# Altium project Challenge_2_actual.PrjPcb
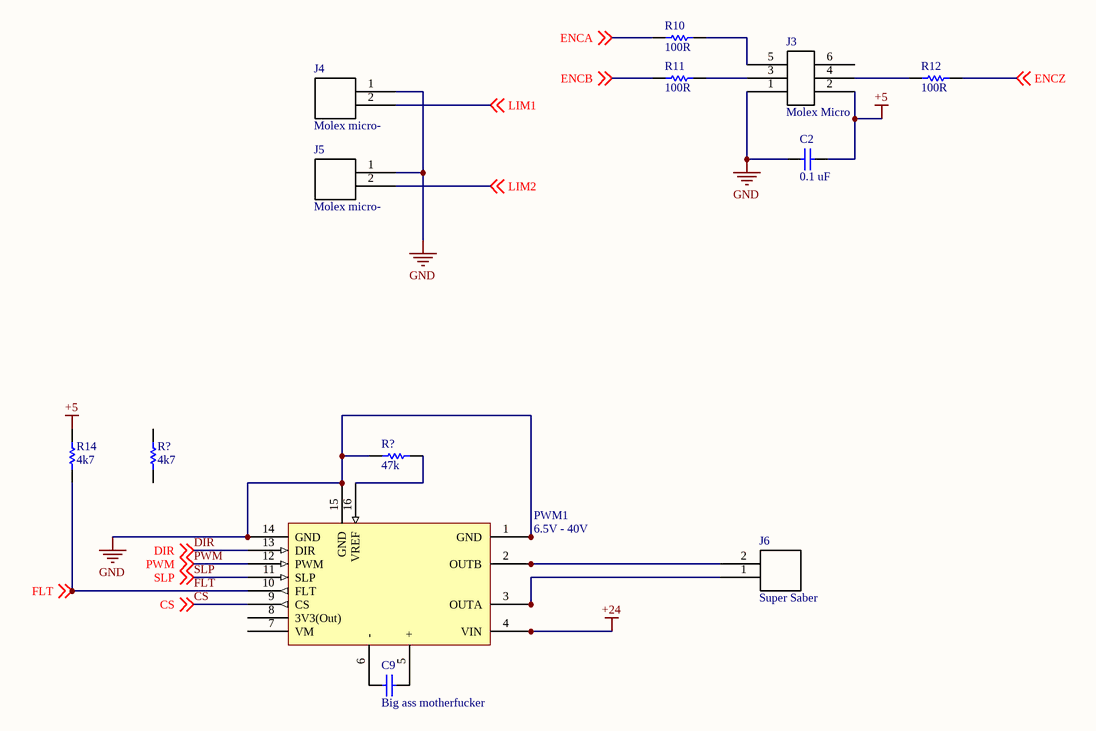
[diagram p0: Motor_Interface.SchDoc]
3 sheets, 45 parts. Net scope: flat (ports and power ports of the same name join across sheets).
Board file: Challenge_2_actual.PcbDoc
Sheets:
  Motor_Interface.SchDoc
  CAN.SchDoc
  MC_Sheet.SchDoc

## Sheet Motor_Interface.SchDoc
size B

### Parts
(Parts that share a designator on the sheet are numbered #1, #2 ... from top to bottom, then left to right.)
C2  0.1 uF  [CAPC2013X140X50LL20T25]
C9  Big ass motherfucker  [CAPC2013X140X50LL20T25]
J3  Molex Micro  [microfit 6 pin]
J4  Molex micro-  [Microfit 2 pin]
J5  Molex micro-  [Microfit 2 pin]
J6  Super Saber  [Super Sabre]
PWM1  6.5V - 40V  [Pololu_G2_Driver_24v21]
R10  100R  [RESC0805(2012)_N]
R11  100R  [RESC0805(2012)_N]
R12  100R  [RESC0805(2012)_N]
R14  4k7  [RESC0805(2012)_N]
R?#1  47k  [RESC0805(2012)_N]
R?#2  4k7  [RESC0805(2012)_N]

### Nets
+5: C2.2 J3.2 R14.2
+24: PWM1.4(VIN) PWM1.4a(VIN) PWM1.4b(VIN)
GND: C2.1 J3.1 J4.1 J5.1 PWM1.1(GND) PWM1.1a(GND) PWM1.1b(GND) PWM1.14(GND) PWM1.15(GND) R?#1.1
CS: PWM1.9(CS) ; off-sheet CS
DIR: PWM1.13(DIR) ; off-sheet DIR
ENCA: R10.1 ; off-sheet ENCA
ENCB: R11.1 ; off-sheet ENCB
ENCZ: R12.2 ; off-sheet ENCZ
FLT: PWM1.10(FLT) R14.1 ; off-sheet FLT
LIM1: J4.2 ; off-sheet LIM1
LIM2: J5.2 ; off-sheet LIM2
PWM: PWM1.12(PWM) ; off-sheet PWM
SLP: PWM1.11(SLP) ; off-sheet SLP
NetC9_1: C9.1 PWM1.6(-)
NetC9_2: C9.2 PWM1.5(+)
NetJ3_3: J3.3 R11.2
NetJ3_4: J3.4 R12.1
NetJ3_5: J3.5 R10.2
NetJ6_1: J6.1 PWM1.3(OUTA) PWM1.3a(OUTA) PWM1.3b(OUTA)
NetJ6_2: J6.2 PWM1.2(OUTB) PWM1.2a(OUTB) PWM1.2b(OUTB)
NetPWM1_16: PWM1.16(VREF) R?#1.2

Not connected (* = marked no-connect by the designer): J3 6; PWM1 7(VM) 8(3V3(Out)); R?#2 1 2

### Library data of the parts
C2 C9 = CMP-2000-05810-1: Chip Capacitor, 2.2 uF, +/- 10%, 10 V, -55 to 85 degC, 0805 (2012 Metric), RoHS, Tape and Reel; Manufacturer: AVX; Dielectric: X5R; Rated Voltage: 10V; Capacitance: 2.2µF; Tolerance (%): ±10%; Datasheet Version: 05/2016; Manufacturer URL: http://www.avx.com/; Package Description: 2-Pin Surface Mount Device, Body 2.01 x 1.25 mm; Mounting Technology: SurfaceMount; Case Size/Dimension: 0805; Package Reference: 0805; Datasheet URL: http://datasheets.avx.com/cx5r.pdf
J3 = Molex micro-fit 6-pin (dual row schematic): Molex micro-fit 3.0 dual row connector. P/N 0430450627
J4 J5 = Molex micro-fit 2-pin: Molex micro-fit 3.0. Molex P/N 0430450227
PWM1 = Pololu G2 High-Power Motor Driver 24v21: This discrete MOSFET H-bridge motor driver enables bidirectional control of one high-power DC brushed motor. The small 1.3″ × 0.8″ board supports a wide 6.5 V to 40 V voltage range and is efficient enough to deliver a continuous 21 A without a heat sink. Additional features of this second-generation (G2) driver include reverse-voltage protection along with basic current sensing and current limiting functionality.; ComponentLink1Description: Product Info; ComponentLink1URL: https://www.pololu.com/product/2995/specs
R10-R12 R14 R?#1 R?#2 = Resistor 0805: Generic 0805 Resistor; Tolerance: 5 %; Case-Metric: 2012; Value: 120.00 Ohm; Case-EIA: 0805; Power: 0.125 W; Technology: SMT

## Sheet CAN.SchDoc
size B
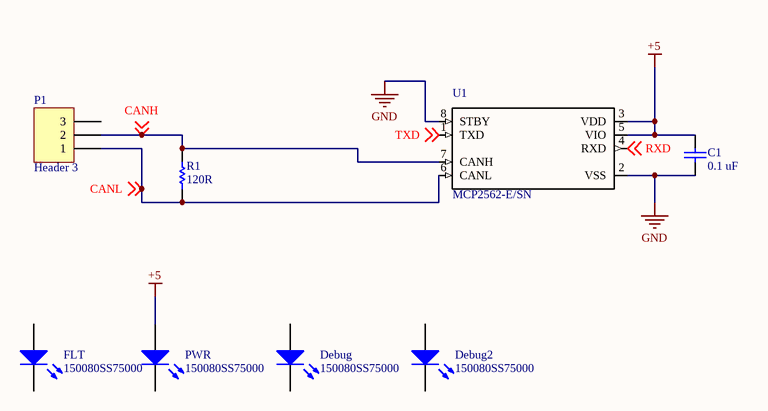
[diagram p1: CAN.SchDoc]

### Parts
C1  0.1 uF  [CAPC2013X140X50LL20T25]
Debug  150080SS75000  [0805_A]
Debug2  150080SS75000  [0805_A]
FLT  150080SS75000  [0805_A]
P1  Header 3  [HDR1X3]
PWR  150080SS75000  [0805_A]
R1  120R  [RESC0805(2012)_N]
U1  MCP2562-E/SN  [SOIC127P600X175-8N]

### Nets
+5: C1.1 PWR.2(A) U1.3(VDD) U1.5(VIO)
GND: C1.2 U1.2(VSS) U1.8(STBY)
CANH: P1.2 R1.2 U1.7(CANH) ; off-sheet CANH
CANL: P1.1 R1.1 U1.6(CANL) ; off-sheet CANL
RXD: U1.4(RXD) ; off-sheet RXD
TXD: U1.1(TXD) ; off-sheet TXD

Not connected (* = marked no-connect by the designer): Debug 1(K) 2(A); Debug2 1(K) 2(A); FLT 1(K) 2(A); P1 3; PWR 1(K)

### Library data of the parts
C1 = CMP-2000-05810-1: as C2 on sheet Motor_Interface; Tolerance (%): ±10%; Datasheet Version: 05/2016; Manufacturer URL: http://www.avx.com/; Package Description: 2-Pin Surface Mount Device, Body 2.01 x 1.25 mm; Mounting Technology: SurfaceMount; Case Size/Dimension: 0805; Package Reference: 0805; Datasheet URL: http://datasheets.avx.com/cx5r.pdf
Debug Debug2 FLT PWR = CMP-1426-00010-1: SMD mono-color Chip LED, WL-SMCW, Super Red; Manufacturer: Wuerth Elektronik; PackageReference: 0805_A; ComponentLink2URL: http://katalog.we-online.com/led/datasheet/150080SS75000.pdf; ComponentLink1URL: http://www.we-online.com; Color: Super Red; ComponentLink2Description: Datasheet; ComponentLink1Description: Manufacturer URL; PartNumber: 150080SS75000
P1 = Header 3: Header, 3-Pin; LatestRevisionDate: 17-Jul-2002; LatestRevisionNote: Re-released for DXP Platform.; Publisher: Altium Limited
R1 = Resistor 0805: as R10 on sheet Motor_Interface; Technology: SMT
U1 = CAN Tranceiver: Microchip MCP2562-E/SN, CAN Transceiver 1MBps 1-channel IEC 61000-4-2, 8-Pin SOIC; Price: None; MF: Microchip; SnapEDA_Link: https://www.snapeda.com/parts/MCP2562-E/SN/Microchip/view-part/?ref=snap; MP: MCP2562-E/SN; Availability: Unavailable; Package: SO-8 Microchip; Value: *

## Sheet MC_Sheet.SchDoc
size B
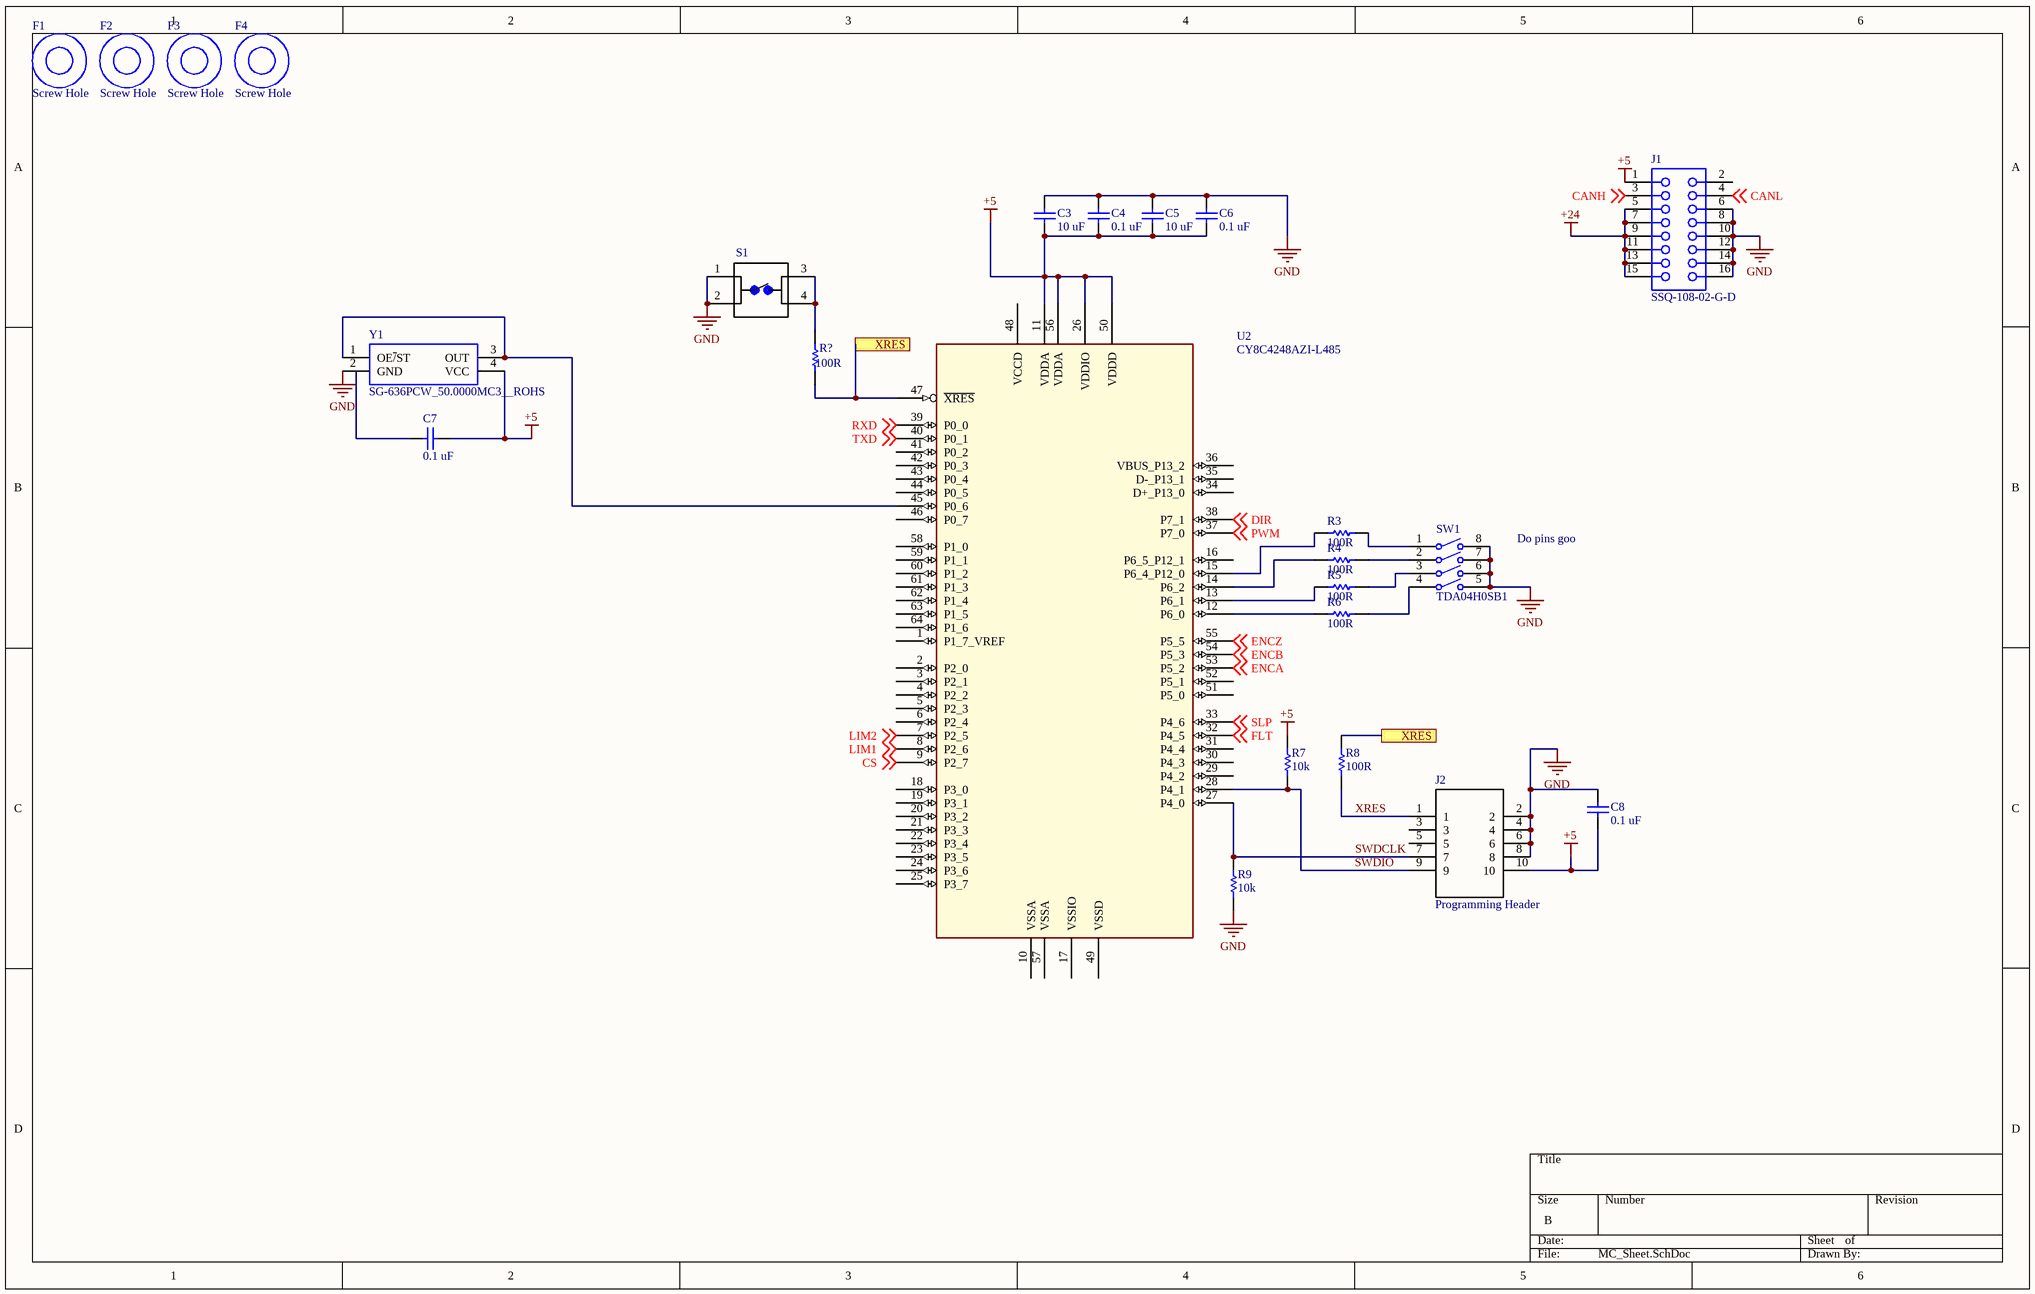
[diagram p2: MC_Sheet.SchDoc]

### Parts
(Parts that share a designator on the sheet are numbered #1, #2 ... from top to bottom, then left to right.)
C3  10 uF  [CAPC2013X140X50LL20T25]
C4  0.1 uF  [CAPC2013X140X50LL20T25]
C5  10 uF  [CAPC2013X140X50LL20T25]
C6  0.1 uF  [CAPC2013X140X50LL20T25]
C7  0.1 uF  [CAPC2013X140X50LL20T25]
C8  0.1 uF  [CAPC2013X140X50LL20T25]
F1  Screw Hole  [Screw Hole]
F2  Screw Hole  [Screw Hole]
F3  Screw Hole  [Screw Hole]
F4  Screw Hole  [Screw Hole]
J1  SSQ-108-02-G-D  [SMTC-SSQ-108-02-X-D]
J2  Programming Header  [programming]
R3  100R  [RESC0805(2012)_N]
R4  100R  [RESC0805(2012)_N]
R5  100R  [RESC0805(2012)_N]
R6  100R  [RESC0805(2012)_N]
R7  10k  [RESC0805(2012)_N]
R8  100R  [RESC0805(2012)_N]
R9  10k  [RESC0805(2012)_N]
R?#3  100R  [RESC0805(2012)_N]
S1  1825910-7  [Switch 6mm 24V (NO)]  (value not drawn)
SW1  TDA04H0SB1  [CKCP-TDA04H0SB1R_V]
U2  CY8C4248AZI-L485  [TQFP50P1200X1200X160-64N]
Y1  SG-636PCW_50.0000MC3__ROHS  [SG-636]

### Ports
XRES

### Nets
+5: C3.1 C4.1 C5.1 C6.1 C7.2 C8.1 J1.1 J2.10 R7.2 U2.11(VDDA) U2.26(VDDIO) U2.50(VDDD) U2.56(VDDA) Y1.4(VCC)
+24: J1.5 J1.7 J1.9 J1.11 J1.13 J1.15
GND: C3.2 C4.2 C5.2 C6.2 C8.2 J1.6 J1.8 J1.10 J1.12 J1.14 J1.16 J2.2 J2.4 J2.6 J2.8 R9.1 S1.1 S1.2 SW1.5 SW1.6 SW1.7 SW1.8 Y1.2(GND)
CANH: J1.3 ; off-sheet CANH
CANL: J1.4 ; off-sheet CANL
CS: U2.9(P2_7) ; off-sheet CS
DIR: U2.38(P7_1) ; off-sheet DIR
ENCA: U2.53(P5_2) ; off-sheet ENCA
ENCB: U2.54(P5_3) ; off-sheet ENCB
ENCZ: U2.55(P5_5) ; off-sheet ENCZ
FLT: U2.32(P4_5) ; off-sheet FLT
LIM1: U2.8(P2_6) ; off-sheet LIM1
LIM2: U2.7(P2_5) ; off-sheet LIM2
PWM: U2.37(P7_0) ; off-sheet PWM
RXD: U2.39(P0_0) ; off-sheet RXD
SLP: U2.33(P4_6) ; off-sheet SLP
SWDCLK: J2.7 R9.2 U2.27(P4_0)
SWDIO: J2.9 R7.1 U2.28(P4_1)
TXD: U2.40(P0_1) ; off-sheet TXD
XRES: J2.1 R8.1
NetR3_1: R3.1 SW1.1
NetR3_2: R3.2 U2.15(P6_4_P12_0)
NetR4_1: R4.1 SW1.2
NetR4_2: R4.2 U2.14(P6_2)
NetR5_1: R5.1 SW1.3
NetR5_2: R5.2 U2.13(P6_1)
NetR6_1: R6.1 SW1.4
NetR6_2: R6.2 U2.12(P6_0)
NetR8_2: R8.2 R?#3.1 U2.47(~{XRES}) ; port XRES
NetR?#3_2: R?#3.2 S1.3 S1.4
NetU2_45: U2.45(P0_6) Y1.1(OE~{/}ST) Y1.3(OUT)

Not connected (* = marked no-connect by the designer): C7 1; J1 2; J2 3 5; U2 1(P1_7_VREF) 2(P2_0) 3(P2_1) 4(P2_2) 5(P2_3) 6(P2_4) 10(VSSA) 16(P6_5_P12_1) 17(VSSIO) 18(P3_0) 19(P3_1) 20(P3_2) 21(P3_3) 22(P3_4) 23(P3_5) 24(P3_6) 25(P3_7) 29(P4_2) 30(P4_3) 31(P4_4) 34(D+_P13_0) 35(D-_P13_1) 36(VBUS_P13_2) 41(P0_2) 42(P0_3) 43(P0_4) 44(P0_5) 46(P0_7) 48(VCCD) 49(VSSD) 51(P5_0) 52(P5_1) 57(VSSA) 58(P1_0) 59(P1_1) 60(P1_2) 61(P1_3) 62(P1_4) 63(P1_5) 64(P1_6)

### Notes on the sheet
- Do pins goo

### Library data of the parts
C3-C8 = CMP-2000-05810-1: as C2 on sheet Motor_Interface; Tolerance (%): ±10%; Datasheet Version: 05/2016; Manufacturer URL: http://www.avx.com/; Package Description: 2-Pin Surface Mount Device, Body 2.01 x 1.25 mm; Mounting Technology: SurfaceMount; Case Size/Dimension: 0805; Package Reference: 0805; Datasheet URL: http://datasheets.avx.com/cx5r.pdf
F1-F4 = Screw Hole: Add 4 of these to your design for screw hole mounting
J1 = CMP-1023-00300-1: SQ Post Socket, Through-hole, Vertical, -55 to 125 degC, 2.54 mm Pitch, 16-Pin, Female, RoHS; Manufacturer: Samtec; Pitch: 2.54 mm; ComponentLink2URL: http://www.samtec.com/documents/webfiles/pdf/SSQ_TH.PDF; ComponentLink3Description: Package Specification; Mounting Technology: Through-hole; RoHS: True; PackageReference: SSQ-108-02-X-D; PartNumber: SSQ-108-02-G-D; Orientation: Vertical; ComponentLink1URL: http://www.samtec.com; DatasheetVersion: F-214; Temperature Range: -55 to 125 degC; PackageDescription: Assembly, Socket Strip .025[0.64] SQ Tail; PackageVersion: BD, 6/1987; ComponentLink2Description: Datasheet; ComponentLink1Description: Manufacturer URL; ComponentLink3URL: http://www.samtec.com/documents/webfiles/cpdf/SSQ-1XX-XX-XXX-X-XX-XXX-XX-X-MKT.pdf
R3-R9 R?#3 = Resistor 0805: as R10 on sheet Motor_Interface; Technology: SMT
S1 = Switch 6mm 24V (NO): FSM4JAH=6MM TACT SWITCH, HIGH TEMP; MF: TE Connectivity; Contact_Current_Rating: 50 mA; Configuration_Pole-Throw: Single Pole - Single Throw; Package: None; Digi-Key_Part_Number: 450-1804-ND; Digi-Key_Purchase_URL: https://www.digikey.com/product-detail/en/te-connectivity-alcoswitch-switches/1825910-7/450-1804-ND/1731414?utm_source=snapeda&utm_medium=aggregator&utm_campaign=symbol; MP: 1825910-7; SnapEDA_Link: https://www.snapeda.com/parts/1825910-7/TE%20Connectivity%20ALCOSWITCH%20Switches/view-part/?ref=snap; EU_RoHS_Compliance: Compliant; TE_purchase_URL: https://www.te.com/usa-en/product-1825910-7.html?te_bu=Cor&te_type=disp&te_campaign=seda_glo_cor-seda-global-disp-prtnr-fy19-seda-model-bom-cta_sma-317_1&elqCampaignId=32493; Value: *
SW1 = Dip Switch Array SMD Half-Pitch: Ultra-Miniature Surface Mount Half-Pitch DIP Switch, 25 mA, 24 V, -40 to 85 degC, 8-Pin SMD, RoHS, Tube; Contact Current Rating: 100 mA; Throw Configuration: SPST; Voltage Rating (DC): 24 V; Max Contact Resistance: 100 mohm; Max Current Rating: 25 mA; REACH SVHC: No SVHC; DatasheetVersion: 02/2016; Case\Package: DIP; Package Quantity: 70; Lead Pitch: 1.27 mm; Contact Plating: Gold; Packaging: Rail/Tube; Contact Finish: Gold; Mount: Surface Mount; Height: 2.3 mm; Contact Material: Copper; Max Operating Temperature: 85 degC; Max Voltage Rating (DC): 24 V; ComponentLink1URL: http://www.ck-components.com/media/1328/tda.pdf; PackageDescription: 8-Pin Surface Mount Device, Body 6.21 x 6.2 mm, Pitch 1.27 mm; Radiation Hardening: No; ComponentLink1Description: Datasheet; Current Rating: 100 mA; RoHSCompliant: true; PackageReference: TDA04H0SB1R; Min Operating Temperature: -40 degC; Pins: 4; Mounting Technology: Surface Mount; Length: 6.21 mm
U2 = PSOC MC: 64 pin psoc; Part_Number: CY8C4248AZI-L485
Y1 = Oscilator: Standard Clock Oscillators; Manufacturer_Name: Epson Timing; Manufacturer_Part_Number: SG-636PCW 50.0000MC3: ROHS; RS Part Number: *; RS Price/Stock: *; Arrow Part Number: SG-636PCW 50.0000MC3: ROHS; Arrow Price/Stock: *; Datasheet Link: http://www.mouser.com/ds/2/137/G-636PCE_en-1003252.pdf

## Nets that join several sheets
+5: Motor_Interface (C2.2 J3.2 R14.2), CAN (C1.1 PWR.2 U1.3 U1.5), MC_Sheet (14 pins)
+24: Motor_Interface (PWM1.4 PWM1.4a PWM1.4b), MC_Sheet (6 pins)
GND: Motor_Interface (10 pins), CAN (C1.2 U1.2 U1.8), MC_Sheet (23 pins)
CANH: CAN (P1.2 R1.2 U1.7), MC_Sheet (J1.3)
CANL: CAN (P1.1 R1.1 U1.6), MC_Sheet (J1.4)
CS: Motor_Interface (PWM1.9), MC_Sheet (U2.9)
DIR: Motor_Interface (PWM1.13), MC_Sheet (U2.38)
ENCA: Motor_Interface (R10.1), MC_Sheet (U2.53)
ENCB: Motor_Interface (R11.1), MC_Sheet (U2.54)
ENCZ: Motor_Interface (R12.2), MC_Sheet (U2.55)
FLT: Motor_Interface (PWM1.10 R14.1), MC_Sheet (U2.32)
LIM1: Motor_Interface (J4.2), MC_Sheet (U2.8)
LIM2: Motor_Interface (J5.2), MC_Sheet (U2.7)
PWM: Motor_Interface (PWM1.12), MC_Sheet (U2.37)
RXD: CAN (U1.4), MC_Sheet (U2.39)
SLP: Motor_Interface (PWM1.11), MC_Sheet (U2.33)
TXD: CAN (U1.1), MC_Sheet (U2.40)